# EasyEDA Pro project PCB.eprj, board PCB4_1
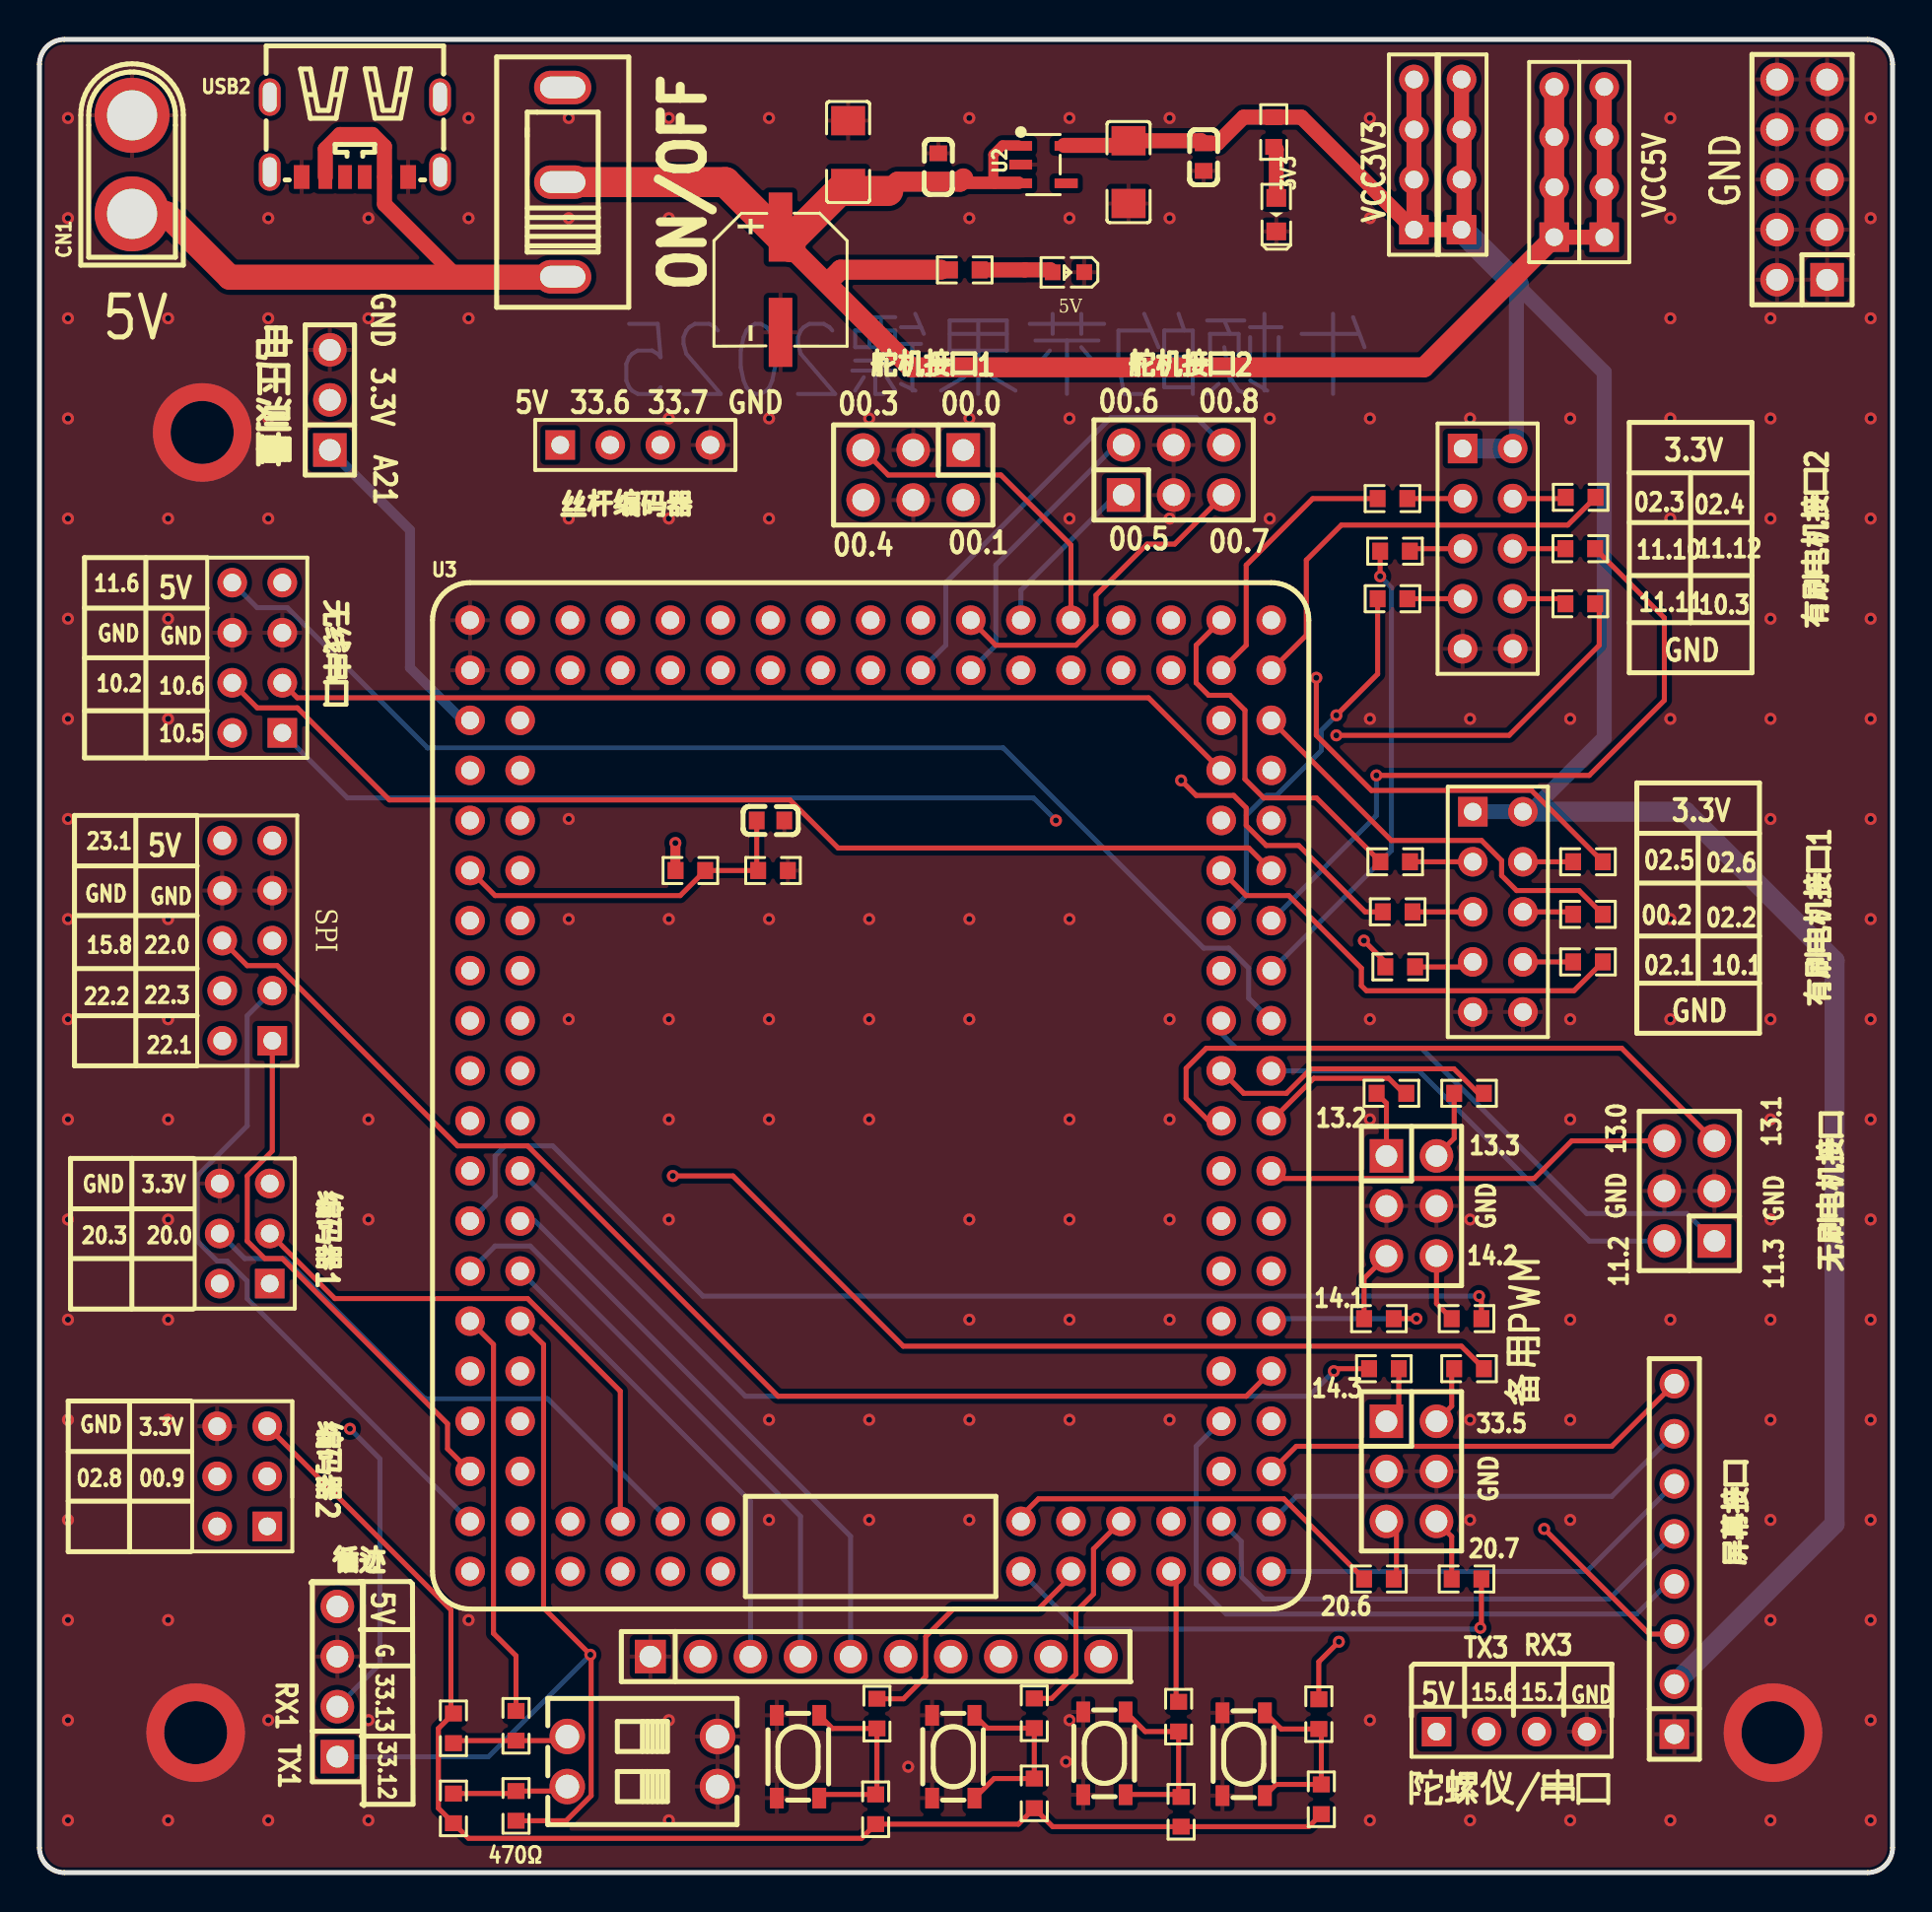
[diagram p5: board, top side]
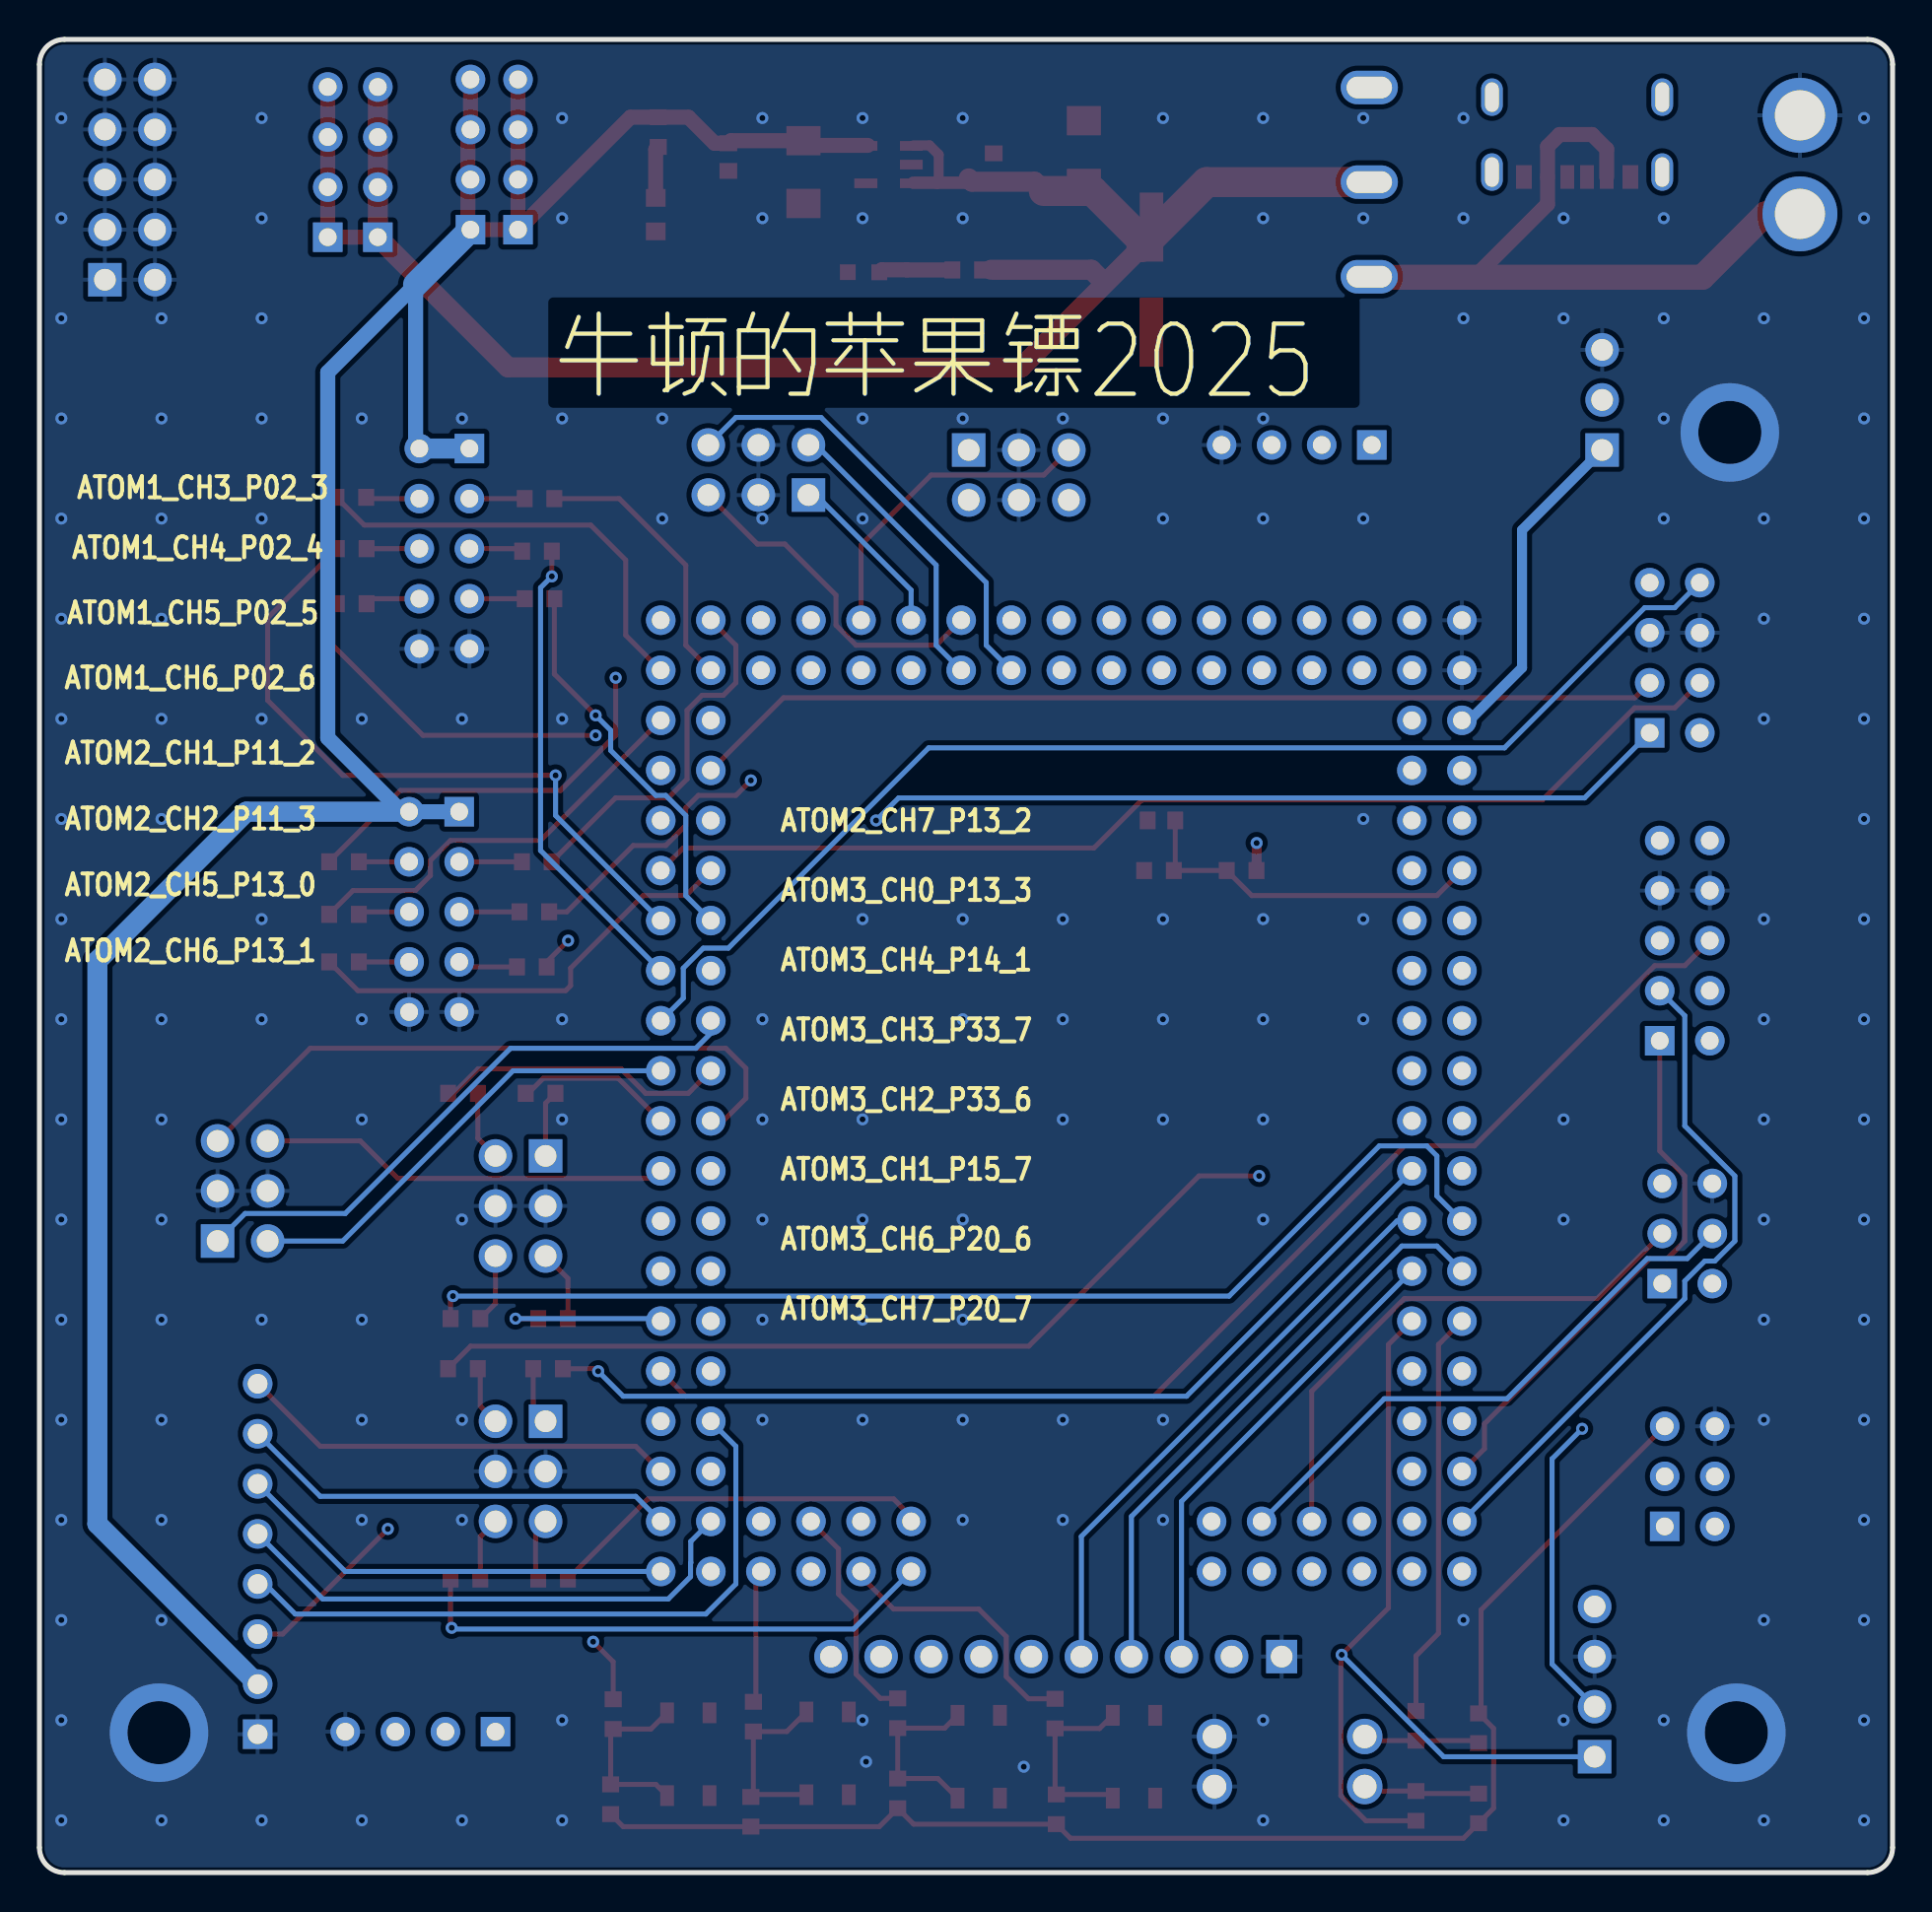
[diagram p6: board, bottom side, seen from below]

Outline 94 x 93 mm; copper layers: Top Layer, 内层1, Inner2, Bottom Layer. Coordinates in mm from the lower left corner of the outline.
Outline path: 0,91.73 0,1.27 arc(0.37,0.37) 1.27,0 92.73,0 arc(93.63,0.37) 94,1.27 94,91.73 arc(93.63,92.63) 92.73,93 1.27,93 arc(0.37,92.63) 0,91.73
Stack: Top Layer 0.035mm 外层铜厚1oz / Dielectric1 0.2104mm 7628 RC49% 8.6mil / 内层1 0.0152mm 内层铜厚 / Dielectric2 1.065mm 1.1mm H/HOZ Copper / Inner2 0.0152mm 内层铜厚 / Dielectric3 0.2104mm 7628 RC49% 8.6mil / Bottom Layer 0.035mm 外层铜厚1oz

## Design rules (mm)
template: JLCPCB Capability(Two Layers Board)
spacing copperThickness1oz (default): track to track 0.102, other pairs 0.152 to 0.3
spacing copperThickness2oz: track to track 0.203, other pairs 0.152 to 0.3
track width copperThickness1oz (default): min 0.127, default 0.254, max 2.54
track width copperThickness2oz: min 0.203, default 0.254, max 2.54
differential pair differentialPair (default): width min 0.127, default 0.254, max 2.54; gap min 0.152, default 0.152
via viaSize (default): diameter min 0.5, default 0.61, max 10; hole min 0.3, default 0.305, max 6.3

## Placement (name value [footprint] x y rotation side)
3V3  15-21VGC/TR8  [LED0603_GREEN]  62.74 84.11 270 top
5V  NCD0603R1  [LED0603-RD_RED]  52.2 81.19 180 top
C5  100nF  [C0603]  45.59 86.52 270 top
C7  100nF  [C0603]  59.06 87.03 90 top
C15  100nF  [C0603]  37.08 53.38 180 top
C16  10uF  [C1206]  41.02 87.28 270 top
C17  10uF  [C1206]  55.25 86.27 90 top
C18  100uF  [CAP-SMD_BD6.3-L6.6-W6.6-LS7.3-FD]  37.59 80.81 270 top
CN1  XT30U-M  [CONN-TH_XT30U-M]  4.7 86.65 90 top
H1  PZ254V-12-6P  [HDR-TH_6P-P2.54-V-M-R2-C3-S2.54]  44.32 70.9 180 top
H2  PZ254V-12-6P  [HDR-TH_6P-P2.54-V-M-R2-C3-S2.54]  57.53 71.16 0 top
H6  PZ254V-12-6P  [HDR-TH_6P-P2.54-V-M-R2-C3-S2.54]  69.6 20.36 270 top
H7  PZ254V-12-6P  [HDR-TH_6P-P2.54-V-M-R2-C3-S2.54]  69.6 33.82 270 top
H8  PZ254V-12-10P  [HDR-TH_10P-P2.54-V-M-R2-C5-S2.54]  89.41 85.89 90 top
H11  PZ254V-12-6P  [HDR-TH_6P-P2.54-V-M-R2-C3-S2.54]  83.69 34.58 90 top
H12  PZ254V-11-08P  [HDR-TH_8P-P2.54-V-M]  82.93 15.91 90 top
H13  PZ254V-11-04P  [HDR-TH_4P-P2.54-V-M]  15.11 9.69 90 top
H14  PZ254V-11-03P  [HDR-TH_3P-P2.54-V-M]  14.73 74.71 90 top
H15  PZ254V-11-10P  [HDR-TH_10P-P2.54-V-M]  42.42 10.96 0 top
P2  P9  [HDR1X4]  69.72 83.35 90 top
P6  P17  [HDR1X4]  76.84 82.97 90 top
P7  -  [HDR2X4]  12.32 57.82 90 top
P10  -  [HDR2X3]  11.56 17.56 90 top
P11  -  [HDR2X3]  11.68 29.88 90 top
P13  -  [HDR2X5]  11.81 42.2 90 top
P18  -  [HDR2X5]  72.19 72.25 270 top
P19  -  [HDR2X5]  72.71 53.82 270 top
P25  P9  [HDR1X4]  72.14 83.35 90 top
P26  P17  [HDR1X4]  79.38 82.97 90 top
P27  -  [HDR1X4]  70.87 7.15 0 top
P28  -  [HDR1X4]  26.42 72.43 0 top
R4  4.7kΩ  [R0603]  62.61 88.3 270 top
R11  200kΩ  [R0603]  33.02 50.84 0 top
R12  20kΩ  [R0603]  37.21 50.84 0 top
R14  330Ω  [R0603]  46.94 81.31 180 top
R18  470Ω  [R0603]  24.17 7.45 90 top
R19  4.7kΩ  [R0603]  21 7.32 270 top
R20  4.7kΩ  [R0603]  21 3.26 90 top
R21  470Ω  [R0603]  24.17 3.38 270 top
R22  470Ω  [R0603]  42.48 8.06 90 top
R23  470Ω  [R0603]  57.78 7.91 270 top
R24  4.7kΩ  [R0603]  42.42 3.21 90 top
R25  4.7kΩ  [R0603]  57.91 3.08 270 top
R26  4.7kΩ  [R0603]  50.46 4.02 90 top
R27  4.7kΩ  [R0603]  65.02 3.72 270 top
R32  470Ω  [R0603]  50.46 8.08 270 top
R33  470Ω  [R0603]  64.9 8.04 270 top
R46  100Ω  [R0603]  68.77 51.28 180 top
R47  100Ω  [R0603]  68.63 69.7 180 top
R48  100Ω  [R0603]  78.18 69.77 180 top
R49  100Ω  [R0603]  78.55 51.28 180 top
R50  100Ω  [R0603]  68.9 48.74 180 top
R51  100Ω  [R0603]  69.02 45.95 180 top
R52  100Ω  [R0603]  78.55 48.61 180 top
R53  100Ω  [R0603]  78.55 46.2 180 top
R54  100Ω  [R0603]  78.16 67.17 180 top
R55  100Ω  [R0603]  78.16 64.37 180 top
R56  100Ω  [R0603]  68.76 67.04 180 top
R57  100Ω  [R0603]  68.63 64.62 180 top
R69  100Ω  [R0603]  68.58 39.53 0 top
R70  100Ω  [R0603]  72.52 39.53 180 top
R71  100Ω  [R0603]  72.39 28.1 180 top
R72  100Ω  [R0603]  67.94 28.1 0 top
R73  100Ω  [R0603]  68.2 25.56 180 top
R74  100Ω  [R0603]  72.52 25.56 180 top
R75  100Ω  [R0603]  67.94 14.9 0 top
R76  100Ω  [R0603]  72.39 14.9 180 top
S2  拨码开关,平拨开关,DSWB02LHGET  [SW-TH_DSWB02LHGET]  30.59 5.63 90 top
S3  SKRPACE010  [KEY-SMD_4P-L4.2-W3.2-P2.20-LS4.6]  38.48 5.88 90 top
S4  SKRPACE010  [KEY-SMD_4P-L4.2-W3.2-P2.20-LS4.6]  46.35 5.88 270 top
S5  SKRPACE010  [KEY-SMD_4P-L4.2-W3.2-P2.20-LS4.6]  54.02 6.05 270 top
S6  SKRPACE010  [KEY-SMD_4P-L4.2-W3.2-P2.20-LS4.6]  61.09 6 270 top
U2  RT9013-33GB  [SOT-23-5_L3.0-W1.7-P0.95-LS2.8-BL]  50.93 86.65 270 top
U3  -  [TC264_CoreBoard]  21.84 63.54 0 top
U15  SS12D10G5  [SW-TH_SHOU-HAN_SS12D10G4]  26.54 85.76 90 top
USB2  TYPE-C 6P  [TYPE-C-SMD_TYPE-C-6P]  16 88.05 180 top

## Footprints (pads in the part's own frame, mm; a bottom-side part is the same pattern mirrored in y, then rotated)
C0603
  rect 0.8x0.9 smd: 1(-0.7,0) 2(0.7,0)
C1206
  rect 1.485x1.728 smd: 1(-1.593,0) 2(1.593,0)
CAP-SMD_BD6.3-L6.6-W6.6-LS7.3-FD
  rect 3.5x1.2 smd: 1(-2.67,0) 2(2.67,0)
CONN-TH_XT30U-M
  round 3.8 hole 2.54: 1(-2.5,0) 2(2.5,0)
HDR1X4
  rect 1.5x1.5 hole 0.9: 1(0,0)
  round 1.5 hole 0.9: 2(2.54,0) 3(5.08,0) 4(7.62,0)
HDR2X3
  rect 1.5x1.5 hole 0.9: 1(0,0)
  round 1.5 hole 0.9: 2(0,2.54) 3(2.54,0) 4(2.54,2.54) 5(5.08,0) 6(5.08,2.54)
HDR2X4
  rect 1.5x1.5 hole 0.9: 1(0,0)
  round 1.5 hole 0.9: 2(0,2.54) 3(2.54,0) 4(2.54,2.54) 5(5.08,0) 6(5.08,2.54) 7(7.62,0) 8(7.62,2.54)
HDR2X5
  rect 1.5x1.5 hole 0.9: 1(0,0)
  round 1.5 hole 0.9: 2(0,2.54) 3(2.54,0) 4(2.54,2.54) 5(5.08,0) 6(5.08,2.54) 7(7.62,0) 8(7.62,2.54) 9(10.16,0) 10(10.16,2.54)
HDR-TH_3P-P2.54-V-M
  rect 1.7x1.7 hole 1.1: 1(-2.54,0)
  round 1.7 hole 1.1: 2(0,0) 3(2.54,0)
HDR-TH_4P-P2.54-V-M
  rect 1.7x1.7 hole 1.1: 1(-3.81,0)
  round 1.7 hole 1.1: 2(-1.27,0) 3(1.27,0) 4(3.81,0)
HDR-TH_6P-P2.54-V-M-R2-C3-S2.54
  rect 1.7x1.7 hole 1.1: 1(-2.54,-1.27)
  round 1.7 hole 1.1: 2(-2.54,1.27) 3(0,-1.27) 4(0,1.27) 5(2.54,-1.27) 6(2.54,1.27)
HDR-TH_8P-P2.54-V-M
  rect 1.5x1.5 hole 1: 1(-8.89,0)
  round 1.5 hole 1: 2(-6.35,0) 3(-3.81,0) 4(-1.27,0) 5(1.27,0) 6(3.81,0) 7(6.35,0) 8(8.89,0)
HDR-TH_10P-P2.54-V-M
  rect 1.575x1.7 hole 1.1: 1(-11.43,0)
  round 1.7 hole 1.1: 2(-8.89,0) 3(-6.35,0) 4(-3.81,0) 5(-1.27,0) 6(1.27,0) 7(3.81,0) 8(6.35,0) 9(8.89,0) 10(11.43,0)
HDR-TH_10P-P2.54-V-M-R2-C5-S2.54
  rect 1.7x1.7 hole 1.1: 1(-5.08,-1.27)
  round 1.7 hole 1.1: 2(-5.08,1.27) 3(-2.54,-1.27) 4(-2.54,1.27) 5(0,-1.27) 6(0,1.27) 7(2.54,-1.27) 8(2.54,1.27) 9(5.08,-1.27) 10(5.08,1.27)
KEY-SMD_4P-L4.2-W3.2-P2.20-LS4.6
  rect 1.05x0.7 smd: 1(-2.1,1.075) 2(2.1,1.075) 3(-2.1,-1.075) 4(2.1,-1.075)
LED0603-RD_RED
  rect 0.8x0.8 smd: 1(-0.799,-0.004) 2(0.799,0.004)
LED0603_GREEN
  rect 0.9x1 smd: 1(-0.85,0) 2(0.85,0)
R0603
  rect 0.806x0.864 smd: 1(-0.753,0) 2(0.753,0)
SOT-23-5_L3.0-W1.7-P0.95-LS2.8-BL
  rect 0.49x1.157 smd: 1(-0.95,-1.153) 2(0,-1.153) 3(0.95,-1.153)
  rect 0.49x1.175 smd: 4(0.95,1.153) 5(-0.95,1.153)
SW-TH_DSWB02LHGET
  round 1.8 hole 1.2: 1(-1.27,3.81) 2(1.27,3.81) 3(-1.27,-3.81) 4(1.27,-3.81)
SW-TH_SHOU-HAN_SS12D10G4
  oval 1.7x2.9 hole 1.1x2.3: 1(-4.8,0) 2(0,0) 3(4.8,0)
TC264_CoreBoard
  round 1.5 hole 0.9: 1(0,0) 2(2.54,0) 3(0,-2.54) 4(2.54,-2.54) 5(0,-5.08) 6(2.54,-5.08) 7(0,-7.62) 8(2.54,-7.62) 9(0,-10.16) 10(2.54,-10.16) 11(0,-12.7) 12(2.54,-12.7) 13(0,-15.24) 14(2.54,-15.24) 15(0,-17.78) 16(2.54,-17.78) 17(0,-20.32) 18(2.54,-20.32) 19(0,-22.86) 20(2.54,-22.86) 21(0,-25.4) 22(2.54,-25.4) 23(0,-27.94) 24(2.54,-27.94) 25(0,-30.48) 26(2.54,-30.48) 27(0,-33.02) 28(2.54,-33.02) 29(0,-35.56) 30(2.54,-35.56) 31(0,-38.1) 32(2.54,-38.1) 33(0,-40.64) 34(2.54,-40.64) 35(0,-43.18) 36(2.54,-43.18) 37(0,-45.72) 38(2.54,-45.72) 39(0,-48.26) 40(2.54,-48.26) 41(5.08,-48.26) 42(5.08,-45.72) 43(7.62,-48.26) 44(7.62,-45.72) 45(10.16,-48.26) 46(10.16,-45.72) 47(12.7,-48.26) 48(12.7,-45.72) 49(27.94,-45.72) 50(27.94,-48.26) 51(30.48,-45.72) 52(30.48,-48.26) 53(33.02,-45.72) 54(33.02,-48.26) 55(35.56,-45.72) 56(35.56,-48.26) 57(38.1,-48.26) 58(40.64,-48.26) 59(38.1,-45.72) 60(40.64,-45.72) 61(38.1,-43.18) 62(40.64,-43.18) 63(38.1,-40.64) 64(40.64,-40.64) 65(38.1,-38.1) 66(40.64,-38.1) 67(38.1,-35.56) 68(40.64,-35.56) 69(38.1,-33.02) 70(40.64,-33.02) 71(38.1,-30.48) 72(40.64,-30.48) 73(38.1,-27.94) 74(40.64,-27.94) 75(38.1,-25.4) 76(40.64,-25.4) 77(38.1,-22.86) 78(40.64,-22.86) 79(38.1,-20.32) 80(40.64,-20.32) 81(38.1,-17.78) 82(40.64,-17.78) 83(38.1,-15.24) 84(40.64,-15.24) 85(38.1,-12.7) 86(40.64,-12.7) 87(38.1,-10.16) 88(40.64,-10.16) 89(38.1,-7.62) 90(40.64,-7.62) 91(38.1,-5.08) 92(40.64,-5.08) 93(38.1,-2.54) 94(40.64,-2.54) 95(38.1,0) 96(40.64,0) 97(35.56,-2.54) 98(35.56,0) 99(33.02,-2.54) 100(33.02,0) 101(30.48,-2.54) 102(30.48,0) 103(27.94,-2.54) 104(27.94,0) 105(25.4,-2.54) 106(25.4,0) 107(22.86,-2.54) 108(22.86,0) 109(20.32,-2.54) 110(20.32,0) 111(17.78,-2.54) 112(17.78,0) 113(15.24,-2.54) 114(15.24,0) 115(12.7,-2.54) 116(12.7,0) 117(10.16,-2.54) 118(10.16,0) 119(7.62,-2.54) 120(7.62,0) 121(5.08,-2.54) 122(5.08,0)
TYPE-C-SMD_TYPE-C-6P
  oval 1.1x1.9 hole 0.7x1.5: 7(-4.32,1.775) 7(-4.32,-2.025) 7(4.32,1.775) 7(4.32,-2.025)
  rect 0.7x1.2 smd: A5(-0.5,2.025) A9(1.5,2.025) B5(0.5,2.025) B9(-1.5,2.025)
  rect 0.8x1.2 smd: A12(2.7,2.025) B12(-2.7,2.025)

## Nets
As in the schematic.

Pads without a net: P7 2; P10 1 2; P11 1 2; P13 2; U2 4; U15 3; USB2 7 A5 B5

## Via types
v1: diameter 0.61, hole 0.305, Top Layer to Bottom Layer, 189 vias
v2: diameter 5, hole 3.2, Top Layer to Bottom Layer, 3 vias

## Routing (per net, layer and track width the routed paths; a pad name or vN(x,y) marks a point on that pad's centre or on a via; arc(x,y) is an arc through that point)
GND:
  vias: v1(1.45,89.01) v1(1.45,83.93) v1(1.45,78.85) v1(1.45,73.77) v1(1.45,68.69) v1(1.45,63.61) v1(1.45,58.53) v1(1.45,53.45) v1(1.45,48.37) v1(1.45,43.29) v1(1.45,38.21) v1(1.45,33.13) v1(1.45,28.05) v1(1.45,22.97) v1(1.45,17.89) v1(1.45,12.81) v1(1.45,7.73) v1(1.45,2.65) v1(6.53,78.85) v1(6.53,68.69) v1(6.53,63.61) v1(6.53,58.53) v1(6.53,48.37) v1(6.53,43.29) v1(6.53,38.21) v1(6.53,33.13) v1(6.53,28.05) v1(6.53,22.97) v1(6.53,12.81) v1(6.53,2.65) v1(11.61,83.93) v1(11.61,78.85) v1(11.61,73.77) v1(11.61,68.69) v1(11.61,7.73) v1(11.61,2.65) v1(16.69,83.93) v1(16.69,78.85) v1(16.69,38.21) v1(16.69,33.13) v1(16.69,7.73) v1(16.69,2.65) v1(21.77,89.01) v1(21.77,83.93) v1(21.77,78.85) v1(21.77,12.81) v1(26.85,89.01) v1(26.85,83.93) v1(26.85,68.69) v1(26.85,53.45) v1(26.85,48.37) v1(26.85,43.29) v1(31.93,89.01) v1(31.93,83.93) v1(31.93,73.77) v1(31.93,68.69) v1(31.93,48.37) v1(31.93,43.29) v1(31.93,38.21) v1(31.93,33.13) v1(31.93,7.73) v1(31.93,2.65) v1(37.01,89.01) v1(37.01,73.77) v1(37.01,68.69) v1(37.01,48.37) v1(37.01,43.29) v1(37.01,38.21) v1(37.01,22.97) v1(37.01,17.89) v1(42.09,73.77) v1(42.09,48.37) v1(42.09,43.29) v1(42.09,38.21) v1(42.09,22.97) v1(42.09,17.89) v1(44.07,5.37) v1(47.17,89.01) v1(47.17,83.93) v1(47.17,73.77) v1(47.17,48.37) v1(47.17,43.29) v1(47.17,33.13) v1(47.17,28.05) v1(47.17,22.97) v1(47.17,17.89) v1(52.07,5.62) v1(52.25,89.01) v1(52.25,83.93) v1(52.25,73.77) v1(52.25,68.69) v1(52.25,48.37) v1(52.25,38.21) v1(52.25,33.13) v1(52.25,28.05) v1(52.25,22.97) v1(52.25,7.73) v1(57.33,89.01) v1(57.33,83.93) v1(57.33,68.69) v1(57.33,43.29) v1(57.33,38.21) v1(57.33,33.13) v1(57.33,28.05) v1(57.33,22.97) v1(62.41,73.77) v1(62.41,68.69) v1(67.49,89.01) v1(67.49,83.93) v1(67.49,73.77) v1(67.49,58.53) v1(67.49,43.29) v1(67.49,38.21) v1(67.49,7.73) v1(67.49,2.65) v1(72.57,73.77) v1(72.57,58.53) v1(72.57,33.13) v1(72.57,22.97) v1(72.57,17.89) v1(72.57,2.65) v1(77.65,73.77) v1(77.65,58.53) v1(77.65,43.29) v1(77.65,38.21) v1(77.65,28.05) v1(77.65,22.97) v1(77.65,17.89) v1(77.65,2.65) v1(82.73,89.01) v1(82.73,83.93) v1(82.73,78.85) v1(82.73,73.77) v1(82.73,68.69) v1(82.73,58.53) v1(82.73,48.37) v1(82.73,43.29) v1(82.73,28.05) v1(82.73,2.65) v1(87.81,78.85) v1(87.81,73.77) v1(87.81,68.69) v1(87.81,63.61) v1(87.81,58.53) v1(87.81,53.45) v1(87.81,43.29) v1(87.81,38.21) v1(87.81,33.13) v1(87.81,28.05) v1(87.81,22.97) v1(87.81,17.89) v1(87.81,12.81) v1(87.81,2.65) v1(92.89,89.01) v1(92.89,83.93) v1(92.89,78.85) v1(92.89,73.77) v1(92.89,68.69) v1(92.89,63.61) v1(92.89,58.53) v1(92.89,53.45) v1(92.89,48.37) v1(92.89,43.29) v1(92.89,38.21) v1(92.89,33.13) v1(92.89,28.05) v1(92.89,22.97) v1(92.89,17.89) v1(92.89,12.81) v1(92.89,7.73) v1(92.89,2.65) v2(7.92,7.1) v2(8.25,73.06) v2(87.94,7.1)
VCC3V3: length 334.4
  Top Layer w0.254: P10.5 20.87,13.33 20.87,8.2 R19.1 20.24,7.31 20.24,3.26 21.76,1.74 41.7,1.74 R24.1 49.66,2.46 R26.1 51.4,2.33 R25.2 64.39,2.33 R27.2
  Top Layer w0.762: 51.98,87.63 55.01,87.63 C17.2 58.92,87.86 59.06,87.73 59.75,87.73 61.08,89.05 R4.1 64.02,89.05 P2.1 ; P2.4 P2.3 P2.2 P2.1 ; P2.1 72.26,83.35 72.26,88.43 ; P25.3 P25.4 ; P18.1 72.32,72.25
  Top Layer w1.016: 72.32,72.25 72.19,72.37 P18.1
  内层1 w1.524: 22.1,74.71 23.45,76.06 64.34,76.06 69.72,81.44 P2.1 ; 22.1,74.71 17.65,70.27 17.65,40.93 P11.5 12.19,34.96 14.22,32.93 14.22,25.31 P10.5 ; 22.1,74.71 H14.2
  Bottom Layer w0.762: P19.1 P19.2 75.63,53.82 79.38,57.57 79.38,76.11 74.92,80.56 74.92,72.43 P18.2
  Bottom Layer w1.016: 75.63,53.82 83.5,53.82 91.06,46.26 91.06,17.69 H12.2 ; P18.1 P18.2
  Bottom Layer w1.27: P25.1 74.92,80.56
VCC5V: length 341.3
  Top Layer w0.508: R11.1 32.26,50.84 v1(32.26,52.23) ; 48.46,85.73 48.39,85.8 48.39,87.16 48.85,87.63 49.67,87.63
  Top Layer w0.635: 46.69,85.78 46.75,85.73 49.67,85.73
  Top Layer w0.762: P6.1 P26.1 P26.2 P26.3 79.38,90.59
  Top Layer w1.016: 40.26,80.94 40.64,81.32 45.72,81.32 ; 43.05,85.31 43.52,85.78 46.69,85.78 46.86,85.95 ; 76.84,90.59 P6.3 P6.2 P6.1 70.23,76.36 44.2,76.36 38.1,82.46
  Top Layer w1.524: 37.91,82.65 34.8,85.76 U15.2 ; 37.91,82.65 40.57,85.31 43.05,85.31 ; 37.91,82.65 38.1,82.46
  内层1 w1.524: P13.9 11.81,52.87 10.29,54.39 6.35,54.39 4.49,52.53 4.49,18.79 9.78,13.5 H13.4
  Inner2 w0.254: 24.38,61.39 U3.4
  Inner2 w0.508: U3.4 32.26,53.12 v1(32.26,52.23)
  Inner2 w1.016: H13.4 19.69,8.93 31.75,8.93 33.53,10.7 H15.2 ; U15.2 29.97,82.33 29.97,75.98 P28.1 ; U3.2 24.38,61.39 ; P13.9 12.42,52.96 15.21,52.96 15.75,53.5 15.75,62.01 P7.7
  Inner2 w1.27: 70.87,6.64 70.87,7.53 73.03,9.69 75.44,9.69 79.38,13.62 P26.1
  Inner2 w1.524: U15.2 23.88,83.09 23.88,68.71 ; 23.88,68.71 15.59,68.71 P7.7 ; 23.88,68.71 23.88,65.95 24.38,65.44 U3.2
VCCIN: length 36.3
  Top Layer w0.762: USB2.A9 14.5,87.44 15.24,88.17 16.89,88.17 17.5,87.56 USB2.B9 17.5,84.64 21.18,80.96
  Top Layer w1.27: U15.1 26.52,80.94 9.65,80.94 6.44,84.15 CN1.1
A11: length 18.2
  Top Layer w0.254: C15.2 36.38,50.91 R12.1 R11.2 32.5,49.57 23.11,49.57 U3.11
A21: length 16.9
  Bottom Layer w0.508: U3.5 21.46,58.46 18.8,61.12 18.8,68.11 H14.1
P00.0: length 15.1
  Inner2 w0.254: U3.99 53.47,62.39 53.47,66.58 47.88,72.17 H1.1
P00.1: length 10.5
  内层1 w0.508: U3.100 48.77,69.63 H1.2
P00.2: length 21.4
  Top Layer w0.254: v1(57.91,55.41) 58.67,54.65 60.58,54.65 61.21,54.01 61.21,53.12 62.23,52.11 63.88,52.11 67.25,48.74 R50.2
  Inner2 w0.254: U3.101 v1(57.91,55.41)
P00.3: length 16.3
  Top Layer w0.254: H1.5 43.05,70.9 48.77,70.9 52.32,67.35 U3.102
P00.4: length 13.3
  Inner2 w0.254: U3.103 48.51,62.27 48.51,64.68 45.34,67.85 43.05,67.85 41.78,69.12 H1.6
P00.5: length 8.7
  Bottom Layer w0.254: H2.1 54.61,69.89 49.78,65.06 U3.104
P00.6: length 14.9
  Bottom Layer w0.254: U3.105 48.51,62.27 48.51,66.33 54.61,72.43 H2.2
P00.7: length 17.4
  Top Layer w0.254: U3.106 48.51,62.27 52.58,62.27 53.59,63.28 53.59,64.81 56.19,67.4 57.58,67.4 H2.5
P00.8: length 23.1
  Bottom Layer w0.254: U3.107 45.97,62.27 45.97,65.44 54.36,73.82 58.67,73.82 H2.6
P00.9: length 66.3
  Inner2 w0.254: P10.3 12.57,19.09 24.77,19.09 43.56,37.88 43.56,62.39 U3.108
P02.1: length 17
  Top Layer w0.254: R51.2 68.27,46.19 v1(67.18,47.28)
  内层1 w0.254: v1(67.18,47.28) 67.06,47.28 66.04,48.3 66.04,51.85 63.25,54.65 61.59,54.65 61.21,55.03 61.21,57.19 U3.91
P02.2: length 21.3
  Top Layer w0.254: U3.92 68.58,52.36 73.15,52.36 74.17,51.34 74.17,50.58 74.93,49.82 78.1,49.82 R52.1
P02.3: length 13.9
  Top Layer w0.254: U3.93 61.21,62.27 61.21,66.33 64.59,69.7 R47.2
P02.4: length 22.3
  Top Layer w0.254: U3.94 64.26,62.77 64.26,66.58 66.04,68.36 77.52,68.36 R48.1
P02.5: length 18.9
  Top Layer w0.254: U3.95 58.67,62.27 58.67,60.36 59.31,59.73 60.39,59.73 61.15,58.96 61.15,55.47 62.1,54.52 64.78,54.52 R46.2
P02.6: length 24
  Top Layer w0.254: v1(64.77,60.61) 64.77,57.69 67.56,54.9 75.68,54.9 R49.1
  Inner2 w0.254: U3.96 62.48,62.9 v1(64.77,60.61)
P02.8: length 74.7
  内层1 w0.381: U3.98 56.13,62.27 56.13,48.04 29.59,21.5 10.41,21.5 P10.4
P10.1: length 23
  Top Layer w0.254: U3.85 61.21,49.57 63.37,49.57 67.06,45.88 67.06,44.99 67.31,44.74 77.84,44.74 R53.1
P10.2: length 56.7
  Top Layer w0.254: U3.86 61.34,51.98 40.51,51.98 38.07,54.42 17.75,54.42 13.08,59.09 11.05,59.09 P7.4
P10.3: length 25.1
  Top Layer w0.254: v1(65.79,57.69) 74.55,57.69 79.12,62.27 79.12,64.16 R55.1
  Inner2 w0.254: v1(65.79,57.69) 62.74,54.65 61.21,54.65 U3.87
P10.5: length 53.1
  Inner2 w0.254: v1(51.56,53.38) 52.83,52.11 61.21,52.11 U3.88
  Bottom Layer w0.254: P7.1 15.62,54.52 50.42,54.52 v1(51.56,53.38)
P10.6: length 49.5
  Top Layer w0.254: U3.89 56.26,59.6 13.08,59.6 P7.3
P11.2: length 23.5
  Bottom Layer w0.254: U3.78 69.98,40.68 78.61,32.04 H11.2
P11.3: length 30
  Bottom Layer w0.254: U3.79 59.94,42.58 60.71,41.82 70.1,41.82 78.49,33.44 83.57,33.44 H11.1
P11.6: length 62.8
  Bottom Layer w0.254: U3.80 61.34,44.36 61.34,45.88 60.32,46.9 59.06,46.9 48.9,57.06 19.69,57.06 12.57,64.17 11.05,64.17 P7.8
P11.10: length 24
  Top Layer w0.254: v1(68.01,65.76) R56.2
  Bottom Layer w0.254: U3.82 68.58,51.85 68.58,65.19 v1(68.01,65.76)
P11.11: length 19.9
  Top Layer w0.254: R57.2 67.88,60.81 v1(65.79,58.71)
  Bottom Layer w0.254: U3.83 61.21,49.57 61.21,53.63 62.23,54.65 62.74,54.65 65.02,56.93 65.02,57.95 v1(65.79,58.71)
P11.12: length 34.9
  Top Layer w0.254: v1(67.82,55.66) 78.61,55.66 82.42,59.47 82.42,63.65 R54.1
  Bottom Layer w0.254: v1(67.82,55.66) 67.82,53.63 U3.84
P13.0: length 20.9
  Top Layer w0.254: H11.6 77.72,37.12 75.82,35.22 62.87,35.22 U3.74
P13.1: length 32.9
  Top Layer w0.254: H11.5 80.26,41.82 59.18,41.82 58.17,40.8 58.17,39.28 59.31,38.14 U3.75
P13.2: length 8.1
  Top Layer w0.254: R69.2 69.21,39.53 68.44,40.3 64.64,40.3 U3.76
P13.3: length 14.8
  Top Layer w0.254: R70.1 72.99,39.53 71.75,40.78 64.5,40.78 63.25,39.53 61.09,39.53 U3.77
P14.1: length 8.4
  Top Layer w0.254: R72.2 69.72,28.1
  Bottom Layer w0.254: v1(69.85,28.1) 62.61,28.1 U3.68
P15.0: length 22.3
  Bottom Layer w0.254: H12.6 78.49,15.28 U3.58
P15.1: length 27
  Bottom Layer w0.254: U3.59 60.96,16.8 60.96,15.72 60.97,15.7 60.97,15.01 62.1,13.88 79.63,13.88 H12.5
P15.2: length 22.3
  Bottom Layer w0.254: U3.60 63.75,19.09 79.76,19.09 H12.7
P15.3: length 26.4
  Top Layer w0.254: v1(76.33,17.44) 81.66,12.1 H12.3
  Inner2 w0.254: v1(76.33,17.44) 74.55,19.21 61.09,19.21 U3.61
P15.4: length 22.3
  Top Layer w0.254: U3.62 63.75,21.63 79.76,21.63 H12.8
P15.5: length 34.3
  Bottom Layer w0.254: H12.4 82.55,14.64 81.03,13.12 60.2,13.12 58.67,14.64 58.67,21.63 U3.63
P15.6: length 22.8
  内层1 w0.254: U3.64 64.64,20.74 64.64,13.81 68.64,9.81 72.14,9.81 73.41,8.54 73.41,6.64
P15.7: length 29.7
  内层1 w0.254: 75.95,6.64 75.95,9.18 74.04,11.09 69.47,11.09 65.91,14.64 65.91,22.13 63.88,24.17 61.21,24.17 U3.65
P15.8: length 63.3
  Top Layer w0.254: U3.66 61.21,24.17 37.47,24.17 24.77,36.87 21.21,36.87 12.06,46.01 10.54,46.01 P13.6
P20.0: length 27.7
  Top Layer w0.254: P11.3 14.99,29.12 24.77,29.12 29.46,24.42 U3.44
P20.3: length 28.9
  Bottom Layer w0.254: U3.46 25.78,24.04 19.56,24.04 12.45,31.15 10.41,31.15 P11.4
P20.6: length 19.7
  Top Layer w0.254: R75.1 63.13,18.96 50.67,18.96 49.78,18.07 U3.49
P20.7: length 27
  Top Layer w0.254: R76.1 73.14,12.47 v1(73.09,12.42)
  Bottom Layer w0.254: U3.50 52.71,12.35 73.03,12.35 v1(73.09,12.42)
P20.9: length 13.9
  Top Layer w0.254: U3.52 52.32,15.02 50.67,13.37 46.35,13.37 44.96,11.97 44.96,9.94 43.83,8.82 42.48,8.82
P20.10: length 11.3
  Top Layer w0.254: U3.53 53.47,16.42 53.47,14.13 52.58,13.24 52.58,10.07 51.34,8.84 R32.1
P20.13: length 6.8
  Top Layer w0.254: R23.1 57.66,8.79 57.66,15.02 U3.56
P20.14: length 11.4
  Top Layer w0.254: R33.1 64.9,10.7 v1(65.91,11.71)
  Inner2 w0.254: U3.57 59.94,14.26 60.83,13.37 64.25,13.37 v1(65.91,11.71)
P21.2: length 32.3
  内层1 w0.254: H15.10 53.34,10.96 50.06,14.24 38.63,14.24 36.45,16.42 25.78,16.42 U3.38
P21.3: length 23.6
  内层1 w0.254: U3.39 24.51,12.61 42.04,12.61 H15.6
P21.4: length 23.6
  Inner2 w0.254: U3.40 26.69,12.97 43.28,12.97 45.28,10.96 H15.7
P21.5: length 23.6
  内层1 w0.254: H15.8 48.13,10.96 45.77,13.32 29.33,13.32 27.63,15.02 27.18,15.02 U3.41
P21.7: length 23.8
  Inner2 w0.254: H15.9 48.51,13.75 30.73,13.75 29.46,15.02 U3.43
P22.0: length 30
  Inner2 w0.254: P13.5 20.7,38.39 20.7,30.01 21.46,29.25 22.22,29.25 23.24,28.23 23.24,24.04 U3.34
P22.1: length 27.6
  Top Layer w0.254: P13.1 11.81,36.61 10.54,35.34 10.54,32.04 11.43,31.15 12.32,31.15 20.7,22.77 20.7,21.5 U3.35
P22.2: length 31.1
  Inner2 w0.254: P13.4 10.54,43.47 10.54,38.39 20.7,28.23 20.7,24.93 21.46,24.17 22.22,24.17 23.24,23.15 23.24,21.5 U3.36
P22.3: length 34.5
  Bottom Layer w0.254: U3.37 10.54,29.12 10.54,30.01 9.53,31.02 9.02,31.02 8,32.04 8,35.34 10.54,37.88 10.54,43.47 P13.3
P23.1: length 35.7
  Inner2 w0.254: U3.33 20.19,24.55 20.19,27.98 8,40.17 8,51.09 P13.10
P33.5: length 64.9
  Top Layer w0.254: v1(32.13,35.34) 35.18,35.34 43.81,26.71 72.13,26.71 R74.1
  内层1 w0.254: U3.23 20.19,35.6 19.18,34.58 19.18,32.8 20.19,31.79 28.57,31.79 v1(32.13,35.34)
P33.6: length 87.1
  Top Layer w0.254: R73.2 65.79,25.56 v1(65.66,25.44)
  内层1 w0.381: U3.24 28.19,39.41 28.19,71.66 P28.2
  Bottom Layer w0.254: U3.24 35.81,24.17 64.39,24.17 v1(65.66,25.44)
P33.7: length 103.9
  Top Layer w0.254: v1(73.03,29.25) 73.14,29.13 R71.1
  内层1 w0.381: U3.25 23.11,34.33 26.92,34.33 30.73,38.14 30.73,71.66 P28.3
  Bottom Layer w0.254: U3.25 23.11,34.33 23.11,36.36 23.62,36.87 26.03,36.87 33.66,29.25 v1(73.03,29.25)
P33.8: length 29.5
  Bottom Layer w0.254: U3.26 25.15,33.06 41.15,17.05 H15.5
P33.9: length 30.1
  Bottom Layer w0.254: H15.4 38.61,18.07 24.89,31.79 23.11,31.79 U3.27
P33.10: length 24.4
  Bottom Layer w0.254: H15.3 36.07,18.83 U3.28
P33.11: length 20.7
  Top Layer w0.254: U3.29 23.03,26.79 23.03,12.14 24.17,10.99 R18.2
P33.12: length 44.9
  Top Layer w0.254: U3.30 25.57,26.79 25.57,13.43 v1(27.95,11.05) 27.98,11.01 27.98,3.9 26.72,2.63 R21.2
  Bottom Layer w0.254: v1(27.95,11.05) 22.77,5.88 H13.1
P33.13: length 22.9
  内层1 w0.254: v1(15.75,22.51) 18.67,25.44 U3.31
  Bottom Layer w0.254: v1(15.75,22.51) 17.27,20.99 17.27,10.58 H13.2
$1N6457: length 9.5
  Top Layer w0.254: S3.3 39.74,3.96 R24.2 42.48,4.03 R22.1 40.22,7.31 S3.4
$1N6464: length 5.9
  Top Layer w0.254: R20.2 24.05,4.01 R21.1 26.55,4.14 S2.1
$1N6521: length 9.3
  Top Layer w0.254: S4.2 48.42,4.77 R26.2 R32.2 48.08,7.33 S4.1
$1N6523: length 9
  Top Layer w0.254: S6.1 62.98,7.28 R33.2 65.02,7.16 R27.1 62.73,4.47 S6.2
$1N6526: length 9.2
  Top Layer w0.254: S5.1 56.09,7.16 R23.2 57.78,3.96 ; 57.78,3.96 55.11,3.96 S5.2 ; 57.78,3.96 R25.1
$1N6540: length 5.9
  Top Layer w0.254: S2.2 26.57,6.69 R18.1 21.13,6.69 21,6.57
$1N7202: length 2.6
  Top Layer w0.762: 3V3.1 62.74,87.42 R4.2
$1N9792: length 3.2
  Top Layer w0.254: P19.3 R46.1
$1N9831: length 2.8
  Top Layer w0.254: P18.3 R47.1
$1N9876: length 2.7
  Top Layer w0.254: P18.4 77.36,69.7 R48.2
$1N9918: length 2.5
  Top Layer w0.254: P19.4 R49.2
$1N17350: length 3.1
  Top Layer w0.254: P19.5 R50.1
$1N17388: length 3
  Top Layer w0.254: R51.1 72.45,45.95 P19.7
$1N17426: length 2.6
  Top Layer w0.254: R52.2 77.67,48.74 P19.6
$1N17465: length 2.5
  Top Layer w0.254: P19.8 R53.2
$1N17509: length 2.7
  Top Layer w0.254: P18.6 R54.2
$1N17551: length 2.8
  Top Layer w0.254: P18.8 77.15,64.62 R55.2
$1N17596: length 2.7
  Top Layer w0.254: R56.1 69.64,67.17 P18.5
$1N17635: length 2.8
  Top Layer w0.254: P18.7 R57.1
$1N18547: length 3.8
  Top Layer w0.762: R14.1 49.99,81.31 50,81.31 51.27,81.31 5V.2
$1N23155: length 3.4
  Top Layer w0.254: H7.1 68.33,39.03 R69.1
$1N23193: length 3.5
  Top Layer w0.254: H7.2 71.76,37.26 R70.2
$1N23231: length 3.5
  Top Layer w0.254: H7.6 70.87,28.87 R71.2
$1N23269: length 3.6
  Top Layer w0.254: H7.5 67.19,30.14 R72.1
$1N23307: length 3.1
  Top Layer w0.254: H6.1 68.95,23.52 68.95,25.69
$1N23345: length 3.2
  Top Layer w0.254: H6.2 71.64,23.67 71.64,25.82
$1N23388: length 3.2
  Top Layer w0.254: H6.5 68.83,17.31 68.83,15.03 R75.2
$1N23427: length 3.2
  Top Layer w0.254: H6.6 71.64,17.05 R76.2

## Copper pours and planes (outline as drawn; the poured copper is in the pictures)
GND on Top Layer: -4.7,96.3 98.43,96.3 98.43,-3.27 -4.7,-3.27
GND on Bottom Layer: -5.84,98.46 101.73,98.46 101.73,-2.12 -5.84,-2.12
GND on 内层1: -6.48,99.86 99.31,99.86 99.31,-3.52 -6.48,-3.52
GND on Inner2: -9.4,103.67 99.31,103.67 99.31,-5.3 -9.4,-5.3

## Text on the board
Bottom Layer: 牛顿的苹果镖2025
Bottom Silkscreen Layer: ATOM2_CH7_P13_2 | ATOM3_CH0_P13_3 | ATOM3_CH4_P14_1 | ATOM3_CH3_P33_7 | ATOM3_CH2_P33_6 | ATOM3_CH1_P15_7 | ATOM3_CH6_P20_6 | ATOM3_CH7_P20_7 | ATOM1_CH3_P02_3 | ATOM1_CH4_P02_4 | ATOM1_CH5_P02_5 | ATOM2_CH1_P11_2 | ATOM2_CH2_P11_3 | ATOM2_CH5_P13_0 | ATOM2_CH6_P13_1 | ATOM1_CH6_P02_6 | 牛顿的苹果镖2025
Top Silkscreen Layer: 470Ω | 02.8 | GND | 20.3 | 22.2 | 23.1 | 15.8 | 11.6 | 10.2 | 3.3V | 00.9 | 22.0 | 22.3 | 22.1 | 20.0 | 10.6 | 10.5 | 15.6 | 15.7 | G | 33.13 | 33.12 | 14.3 | 14.1 | 13.2 | 20.6 | 14.2 | 20.7 | 13.3 | 33.5 | 02.3 | 11.10 | 11.11 | 00.2 | 02.5 | 02.1 | 02.4 | 11.12 | 10.3 | 02.6 | 02.2 | 10.1 | 13.0 | 11.2 | 13.1 | 11.3 | TX3 | RX3 | RX1 | TX1 | 5V | VCC3V3 | VCC5V | 33.6 | 33.7 | 00.4 | 00.3 | 00.0 | 00.1 | 00.6 | 00.5 | 00.8 | 00.7 | A21 | ON/OFF | 屏幕接口 | 有刷电机接口1 | 无刷电机接口 | SPI | 编码器1 | 编码器2 | 无线串口 | 循迹 | 丝杆编码器 | 舵机接口1 | 舵机接口2 | 有刷电机接口2 | 陀螺仪/串口 | 备用PWM | 电压测量
